# Altium schematic sheet CH1_ANALOG.SCHDOC
size A3; DocumentNumber: 2; SheetNumber: 2; SheetTotal: 4
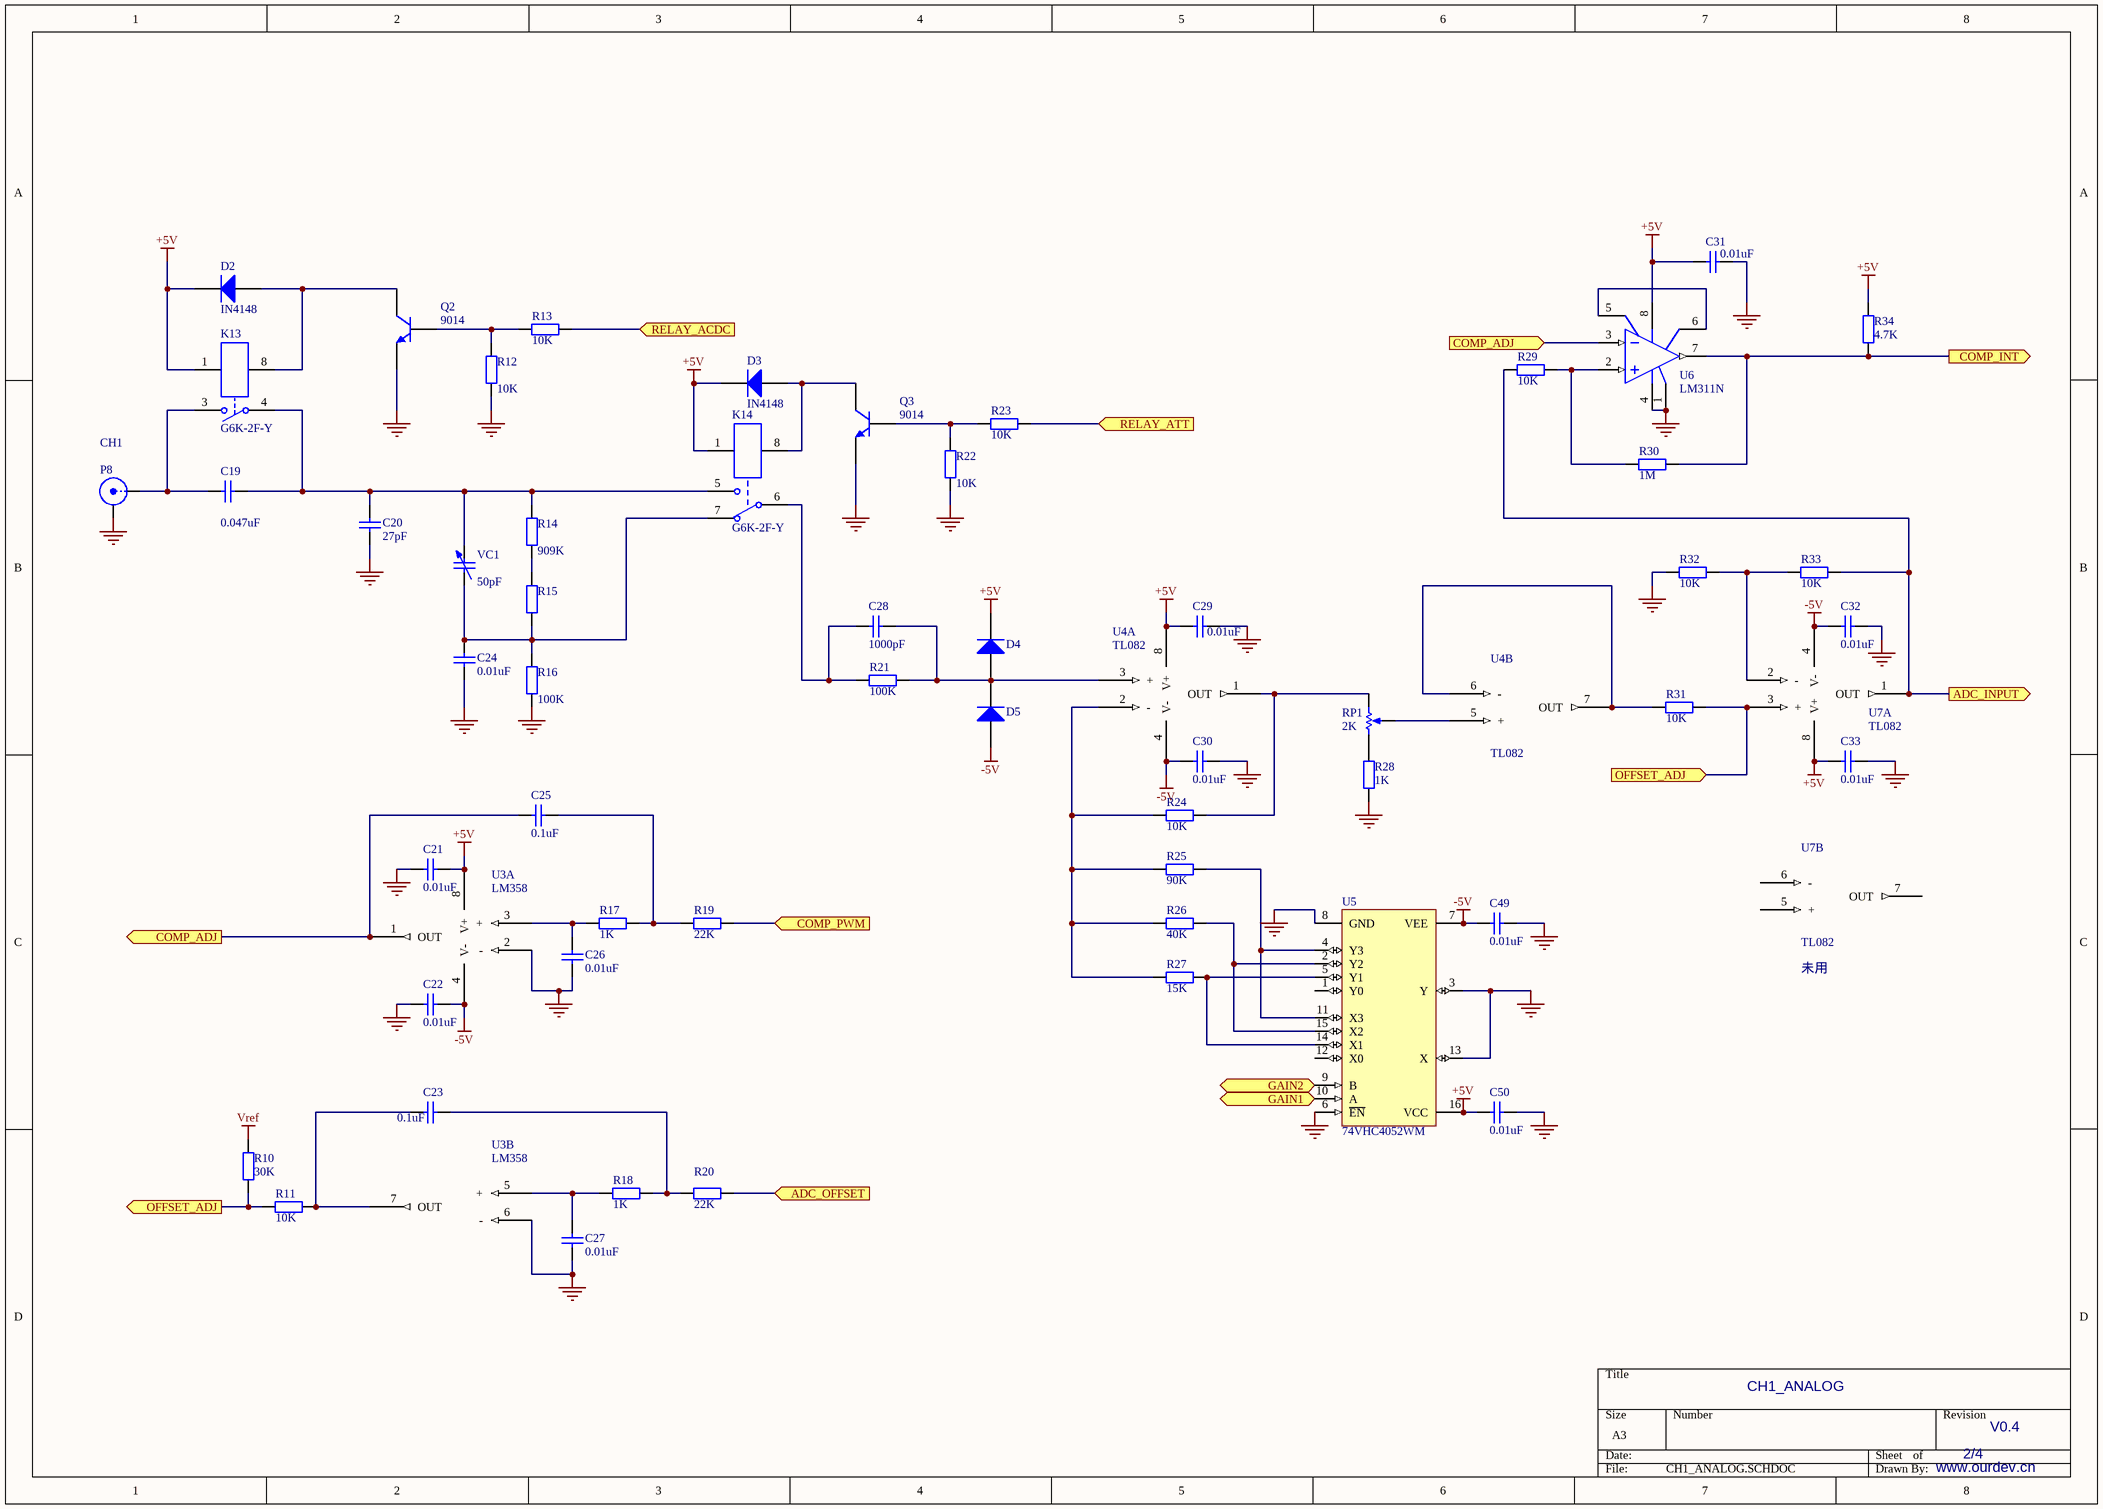
[diagram p0: CH1_ANALOG.SCHDOC]

## Parts
C19  value 0.047uF  [CBB CAP]  (hidden comment: Cap)
C20  value 27pF  [CO2]  (hidden comment: Cap)
C21  value 0.01uF  [CC2012-0805]  (hidden comment: Cap)
C22  value 0.01uF  [CC2012-0805]  (hidden comment: Cap)
C23  value 0.1uF  [CC2012-0805]  (hidden comment: Cap)
C24  value 0.01uF  [C1206]  (hidden comment: Cap)
C25  value 0.1uF  [CC2012-0805]  (hidden comment: Cap)
C26  value 0.01uF  [CC2012-0805]  (hidden comment: Cap)
C27  value 0.01uF  [CC2012-0805]  (hidden comment: Cap)
C28  value 1000pF  [CC2012-0805]  (hidden comment: Cap)
C29  value 0.01uF  [CC2012-0805]  (hidden comment: Cap)
C30  value 0.01uF  [CC2012-0805]  (hidden comment: Cap)
C31  value 0.01uF  [CC2012-0805]  (hidden comment: Cap)
C32  value 0.01uF  [CC2012-0805]  (hidden comment: Cap)
C33  value 0.01uF  [CC2012-0805]  (hidden comment: Cap)
C49  value 0.01uF  [CC2012-0805]  (hidden comment: Cap)
C50  value 0.01uF  [CC2012-0805]  (hidden comment: Cap)
D2  IN4148  [DIODE]
D3  IN4148  [DIODE]
D4  Diode  [SMA]  (value not drawn)
D5  Diode  [SMA]  (value not drawn)
K13  G6K-2F-Y  [G6K-2F-Y]
K14  G6K-2F-Y  [G6K-2F-Y]
P8  CH1  [BNC_RA CON]
Q2  9014  [SOT-23]
Q3  9014  [SOT-23]
R10  value 30K  [CR2012-0805]  (hidden comment: Res2)
R11  value 10K  [CR2012-0805]  (hidden comment: Res2)
R12  value 10K  [CR2012-0805]  (hidden comment: Res2)
R13  value 10K  [CR2012-0805]  (hidden comment: Res2)
R14  value 909K  [R-1206]  (hidden comment: Res2)
R15  Res2  [R-1206]  (value not drawn)
R16  value 100K  [R-1206]  (hidden comment: Res2)
R17  value 1K  [CR2012-0805]  (hidden comment: Res2)
R18  value 1K  [CR2012-0805]  (hidden comment: Res2)
R19  value 22K  [CR2012-0805]  (hidden comment: Res2)
R20  value 22K  [CR2012-0805]  (hidden comment: Res2)
R21  value 100K  [CR2012-0805]  (hidden comment: Res2)
R22  value 10K  [CR2012-0805]  (hidden comment: Res2)
R23  value 10K  [CR2012-0805]  (hidden comment: Res2)
R24  value 10K  [CR2012-0805]  (hidden comment: Res2)
R25  value 90K  [CR2012-0805]  (hidden comment: Res2)
R26  value 40K  [CR2012-0805]  (hidden comment: Res2)
R27  value 15K  [CR2012-0805]  (hidden comment: Res2)
R28  value 1K  [CR2012-0805]  (hidden comment: Res2)
R29  value 10K  [CR2012-0805]  (hidden comment: Res2)
R30  value 1M  [CR2012-0805]  (hidden comment: Res2)
R31  value 10K  [CR2012-0805]  (hidden comment: Res2)
R32  value 10K  [CR2012-0805]  (hidden comment: Res2)
R33  value 10K  [CR2012-0805]  (hidden comment: Res2)
R34  value 4.7K  [CR2012-0805]  (hidden comment: Res2)
RP1  value 2K  [VR]  (hidden comment: RPot)
U3  LM358  [SO-8]  (parts A,B of 2)
U4  TL082  [SO-8]  (parts A,B of 2)
U5  74VHC4052WM  [SO-16]
U6  LM311N  [SO-8]
U7  TL082  [SO-8]  (parts A,B of 2)
VC1  value 50pF  [C1206]  (hidden comment: Cap Var)

## Ports
ADC_INPUT (out), ADC_OFFSET (in), COMP_ADJ (in), COMP_ADJ (out), COMP_INT (out), COMP_PWM (in), GAIN1 (in), GAIN2 (in), OFFSET_ADJ (in), OFFSET_ADJ (out), RELAY_ACDC (in), RELAY_ATT (in)

## Nets
+5V: C21.2 C29.2 C31.2 C33.2 C50.2 D2.2(K) D3.2(K) D4.2(K) K13.1 K14.1 R34.1 U3.8(V+) U4.8(V+) U5.16(VCC) U6.8(V+) U7.8(V+)
-5V: C22.2 C30.2 C32.2 C49.2 D5.1(A) U3.4(V-) U4.4(V-) U5.7(VEE) U7.4(V-)
GND: C20.1 C21.1 C22.1 C24.1 C26.1 C27.1 C29.1 C30.1 C31.1 C32.1 C33.1 C49.1 C50.1 P8.2(Y) Q2.2(E) Q3.2(E) R12.1 R16.1 R22.1 R28.2 R32.1 U3.2(-) U3.6(-) U5.3(Y) U5.6(~{EN}) U5.8(GND) U5.13(X) U6.1(GND) U6.4(V-)
Vref: R10.2
ADC_INPUT: R29.1 R33.1 U7.1(OUT) ; port ADC_INPUT
ADC_OFFSET: R20.2 ; port ADC_OFFSET
COMP_ADJ: C25.1 U3.1(OUT) U6.3(IN-) ; port COMP_ADJ
COMP_INT: R30.2 R34.2 U6.7(OUT) ; port COMP_INT
COMP_PWM: R19.2 ; port COMP_PWM
GAIN1: U5.10(A) ; port GAIN1
GAIN2: U5.9(B) ; port GAIN2
OFFSET_ADJ: R10.1 R11.1 R31.1 U7.3(+) ; port OFFSET_ADJ
RELAY_ACDC: R13.1 ; port RELAY_ACDC
RELAY_ATT: R23.1 ; port RELAY_ATT
NetC19_1: C19.1 K13.3 P8.1(X)
NetC19_2: C19.2 C20.2 K13.4 K14.5 R14.2 VC1.2
NetC23_1: C23.1 R11.2 U3.7(OUT)
NetC23_2: C23.2 R18.2 R20.1
NetC24_2: C24.2 K14.7 R15.1 R16.2 VC1.1
NetC25_2: C25.2 R17.2 R19.1
NetC26_2: C26.2 R17.1 U3.3(+)
NetC27_2: C27.2 R18.1 U3.5(+)
NetC28_1: C28.1 D4.1(A) D5.2(K) R21.1 U4.3(+)
NetC28_2: C28.2 K14.6 R21.2
NetD2_1: D2.1(A) K13.8 Q2.3(C)
NetD3_1: D3.1(A) K14.8 Q3.3(C)
NetQ2_1: Q2.1(B) R12.2 R13.2
NetQ3_1: Q3.1(B) R22.2 R23.2
NetR14_1: R14.1 R15.2
NetR24_1: R24.1 RP1.3(BOT) U4.1(OUT)
NetR24_2: R24.2 R25.2 R26.2 R27.2 U4.2(-)
NetR25_1: R25.1 U5.4(Y3) U5.11(X3)
NetR26_1: R26.1 U5.2(Y2) U5.15(X2)
NetR27_1: R27.1 U5.5(Y1) U5.14(X1)
NetR28_1: R28.1 RP1.1(TOP)
NetR29_2: R29.2 R30.1 U6.2(IN+)
NetR31_2: R31.2 U4.6(-) U4.7(OUT)
NetR32_2: R32.2 R33.2 U7.2(-)
NetRP1_2: RP1.2(TAP) U4.5(+)
NetU6_5: U6.5(BAL) U6.6(BAL/STB)

Not connected (* = marked no-connect by the designer): U5 1(Y0) 12(X0); U7 5(+) 6(-) 7(OUT)

## Notes on the sheet
- (near U7) 未用
- CH1_ANALOG
- 2/4
- V0.4
- www.ourdev.cn

## Library data of the parts
C19-C33 C49 C50 = Cap: Capacitor; Published: 8-Jun-2000; LatestRevisionDate: 17-Jul-2002; LatestRevisionNote: Re-released for DXP Platform.; PackageReference: RAD-0.3; Publisher: Altium Limited
D2-D5 = Diode: Default Diode; Published: 8-Jun-2000; LatestRevisionDate: 17-Jul-2002; LatestRevisionNote: Re-released for DXP Platform.; PackageDocument: Sep-1996; PackageReference: SMC; Publisher: Altium Limited; Code_JEDEC: DO-214-AB
K13 = Relay-SPST: Single-Pole Single-Throw Relay; Published: 24-Mar-1999; LatestRevisionDate: 17-Jul-2002; LatestRevisionNote: Re-released for DXP Platform.; PackageReference: MODULE4; Publisher: Altium Limited
K14 = Relay-SPDT: Single-Pole Dual-Throw Relay; Published: 24-Mar-1999; LatestRevisionDate: 17-Jul-2002; LatestRevisionNote: Re-released for DXP Platform.; PackageReference: MODULE5B; Publisher: Altium Limited
P8 = BNC: BNC Elbow Connector; LatestRevisionDate: 17-Jul-2002; LatestRevisionNote: Re-released for DXP Platform.; Publisher: Altium Limited
Q2 Q3 = NPN: NPN Bipolar Transistor; Published: 8-Jun-2000; LatestRevisionDate: 17-Jul-2002; LatestRevisionNote: Re-released for DXP Platform.; PackageReference: TO-226; Publisher: Altium Limited; Code_JEDEC: TO-226-AA
R10-R34 = Res2: Resistor; Published: 8-Jun-2000; LatestRevisionDate: 17-Jul-2002; LatestRevisionNote: Re-released for DXP Platform.; PackageReference: AXIAL-0.4; Publisher: Altium Limited
RP1 = RPot: Potentiometer; Sim Note: Enter the Resistance value and the set point into parameter fields.; Set Position: 0.5; Published: 8-Jun-2000; LatestRevisionDate: 17-Jul-2002; LatestRevisionNote: Re-released for DXP Platform.; PackageReference: VR5; Publisher: Altium Limited
U5 = 74VHC4052WM: Dual 4-Channel Analog Multiplexer; Published: 17-Jul-2002; LatestRevisionDate: 13-Apr-2006; LatestRevisionNote: IPC-7351 Footprint Added.; DatasheetVersion: Apr-1999; PackageVersion: 2000; PackageReference: M16B; Publisher: Altium Limited; PackageDescription: 16-Pin Small Outline Integrated Circuit 1.27 mm Pitch; Code_JEDEC: MS-013-AA; Code_IPC: SOIC127P1030-16; ComponentLink1Description: Manufacturer Link; ComponentLink1URL: http://www.fairchildsemi.com/; ComponentLink2Description: Datasheet; ComponentLink2URL: http://www.fairchildsemi.com/ds/74%2F74VHC4051.pdf
U6 = LM311N: High-Performance Voltage Comparator; Published: 17-Jul-2002; LatestRevisionDate: 06-Jun-2005; LatestRevisionNote: Stylized 3D Model Added.; DatasheetVersion: 1988; PackageReference: 626-05; Publisher: Altium Limited; PackageDescription: DIP; 8 Leads; Row Spacing 7.62 mm; Pitch 2.54 mm; ComponentLink1Description: Manufacturer Link; ComponentLink1URL: http://www.onsemi.com/site/products/taxonomy/0,4438,133,00.html
VC1 = Cap Var: Variable or Adjustable Capacitor; Published: 24-Mar-1999; LatestRevisionDate: 17-Jul-2002; LatestRevisionNote: Re-released for DXP Platform.; PackageReference: C1210; Publisher: Altium Limited